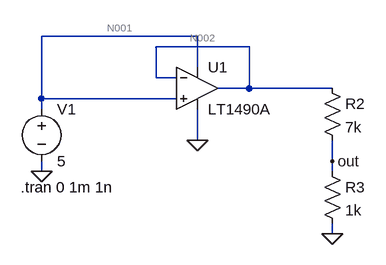
[diagram p0: schematic merac napona.asc]
merac napona.asc, the LTspice schematic file:
Version 4.1
SHEET 1 880 680
WIRE 80 -16 -160 -16
WIRE 160 0 16 0
WIRE 80 32 80 -16
WIRE 16 48 16 0
WIRE 48 48 16 48
WIRE 160 64 160 0
WIRE 160 64 112 64
WIRE 288 64 160 64
WIRE -160 80 -160 -16
WIRE 48 80 -160 80
WIRE -160 96 -160 80
WIRE 80 144 80 96
WIRE 288 176 288 144
WIRE -160 192 -160 176
WIRE 288 192 288 176
WIRE 288 288 288 272
FLAG -160 192 0
FLAG 80 144 0
FLAG 288 288 0
FLAG 288 176 out
SYMBOL voltage -160 80 R0
SYMATTR InstName V1
SYMATTR Value 5
SYMBOL OpAmps\\LT1490A 80 0 R0
SYMATTR InstName U1
SYMBOL res 272 48 R0
SYMATTR InstName R2
SYMATTR Value 7k
SYMBOL res 272 176 R0
SYMATTR InstName R3
SYMATTR Value 1k
TEXT -192 216 Left 2 !.tran 0 1m 1n

The netlist it stands for:
* merac napona.asc
V1 N001 0 5
X§U1 N001 N002 N001 0 N002 LT1490A  ; pins In+ In- V+ V- OUT
R2 N002 out 7k
R3 out 0 1k
.tran 0 1m 1n
.backanno
.end

* Results of the author's LTspice run, read from the files saved beside the schematic
* Operating Point, zero values left out:
*   V(n001) = 5 V
*   V(n002) = 4.962 V
*   V(out) = 620.3 mV
*   I(R2) = 620.3 µA
*   I(R3) = 620.3 µA
*   I(V1) = -652.5 µA
*   Ix(u1:1) = 28.23 nA
*   Ix(u1:2) = 22.75 nA
*   Ix(u1:3) = 652.5 µA
*   Ix(u1:4) = -32.24 µA
*   Ix(u1:5) = -620.3 µA